# EAGLE design samd-2x5-1.27mm (EAGLE 7.7.0)
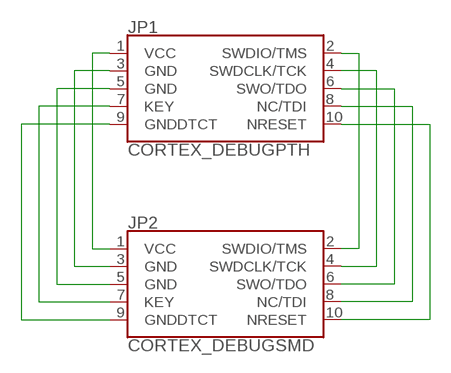
[diagram p0: schematic, sheet 1]

## Parts
JP1  CORTEX_DEBUGPTH  [2X5-PTH-1.27MM]
JP2  CORTEX_DEBUGSMD  [SAMTECH_FTSH-105-01]

## Nets
N$1: JP1.1(VCC) JP2.1(VCC)
N$2: JP1.3(GND) JP2.3(GND)
N$3: JP1.5(GND) JP2.5(GND)
N$4: JP1.7(KEY) JP2.7(KEY)
N$5: JP1.9(GNDDTCT) JP2.9(GNDDTCT)
N$6: JP1.2(SWDIO/TMS) JP2.2(SWDIO/TMS)
N$7: JP1.4(SWDCLK/TCK) JP2.4(SWDCLK/TCK)
N$8: JP1.6(SWO/TDO) JP2.6(SWO/TDO)
N$9: JP1.8(NC/TDI) JP2.8(NC/TDI)
N$10: JP1.10(NRESET) JP2.10(NRESET)

## Library data of the parts
JP1 JP2 = samd5x5:CORTEX_DEBUG: Cortex Debug Connector Datasheet <http://infocenter.arm.com/help/topic/com.arm.doc.faqs/attached/13634/cortex_debug_connectors.pdf>

## Board
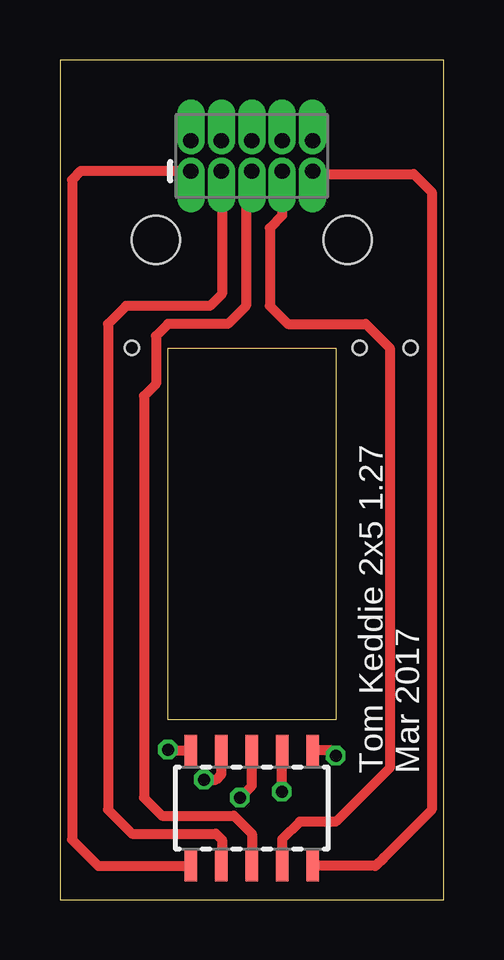
[diagram p1: board, top side]
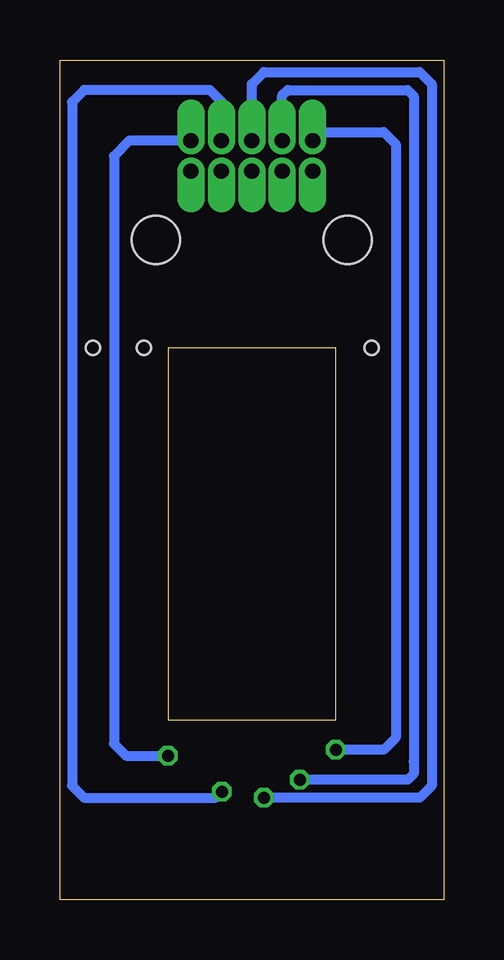
[diagram p2: board, bottom side, seen from below]

Size 16 x 35 mm. Coordinates in mm from the lower left corner, seen from the top.
Outline: 0,0 16,0 16,35 0,35 0,0
Outline: 4.5,23 11.5,23 11.5,7.5 4.5,7.5 4.5,23
Copper layers (1*16): Top 0.035mm / dielectric 1.5mm / Bottom 0.035mm
Design rules "dirt_cheap_dirty_boards.v1.1": minimum track width 5mil, minimum drill 12mil, track to track 5mil, track to pad 5mil, pad to pad 5mil, via to via 5mil, smd to smd 0mil, copper to edge 10mil, drill to drill 10mil, minimum pad ring 10mil, minimum via ring 6mil, stop-mask expansion 2mil, vias tented up to drill 25mil, thermal gap 10mil
Holes 2 mm at 4,27.5 12,27.5
Holes 0.6 mm at 3,23 12.5,23 14.62,23

### Footprints (pad centres in the part's own frame; a part is rotated, then mirrored left to right if it is on the bottom)
2X5-PTH-1.27MM = drill 0.635 pad 1.092 offset: 1 -2.54,-0.635; 2 -2.54,0.635; 3 -1.27,-0.635; 4 -1.27,0.635; 5 0,-0.635; 6 0,0.635; 7 1.27,-0.635; 8 1.27,0.635; 9 2.54,-0.635; 10 2.54,0.635
SAMTECH_FTSH-105-01 = smd 0.508 x 1.27: 1 -2.54,-2.413; 2 -2.54,2.413; 3 -1.27,-2.413; 4 -1.27,2.413; 5 0,-2.413; 6 0,2.413; 7 1.27,-2.413; 8 1.27,2.413; 9 2.54,-2.413; 10 2.54,2.413

### Placement (x,y rotation side)
JP1  8,31 0 top
JP2  8,3.81 0 top

### Tracks (layer width: path | path; a pad name or v marks a point on that pad's centre or on a via)
N$1
  Top 0.406: JP1.1 0.86,30.36 0.5,30 0.5,2.5 1.5,1.5 1.6,1.4 JP2.1
N$2
  Top 0.406: JP1.3 6.75,30.34 6.75,25.25 6.25,24.75 2.75,24.75 2,24 2,3.75 3,2.75 6.5,2.75 6.75,2.5 6.75,1.42 JP2.3
N$3
  Top 0.406: JP1.5 7.75,30 7.75,24.75 7,24 4.5,24 4,23.5 4,21.5 3.5,21 3.5,4.25 4.25,3.5 7.25,3.5 8,2.75 JP2.5
N$4
  Top 0.406: JP1.7 9.27,28.52 8.75,28 8.75,24.75 9.5,24 12.75,24 13.75,23 13.75,5.5 11.5,3.25 10,3.25 9.27,2.52 JP2.7
N$5
  Top 0.406: JP1.9 10.65,30.25 14.75,30.25 15.5,29.5 15.5,3.75 13.5,1.75 13.15,1.4 JP2.9
N$6  (via drill 0.5)
  Top 0.406: v4.5,6.25 4.53,6.22 JP2.2
  Bottom 0.406: JP1.2 5.09,32 2.5,32 2,31.5 2,6.75 2.5,6.25 v4.5,6.25
N$7  (via drill 0.5)
  Top 0.406: v6,5 6.5,5 6.73,5.23 JP2.4
  Bottom 0.406: JP1.4 6.73,33.52 6.5,33.75 1.5,33.75 1.25,33.5 1.25,5.75 1.25,5.25 1.5,5 v6,5
N$8  (via drill 0.5)
  Top 0.406: v7.5,4.25 8,4.75 JP2.6
  Bottom 0.406: JP1.6 8,34 7.5,34.5 1,34.5 0.5,34 0.5,4.75 1,4.25 v7.5,4.25
N$9  (via drill 0.5)
  Top 0.406: v9.25,4.5 9.25,6.2 JP2.8
  Bottom 0.406: JP1.8 9.25,31.66 9.25,33.25 9.75,33.75 15,33.75 15.5,33.25 15.5,4.75 15,4.25 9.5,4.25 v9.25,4.5
N$10  (via drill 0.5)
  Top 0.406: v11.5,6 11.28,6.22 JP2.10
  Bottom 0.406: JP1.10 13.12,31.64 13.75,31 13.75,6.5 13.25,6 v11.5,6

### Text on the board
tPlace: Tom Keddie 2x5 1.27 / Mar 2017